# EAGLE design MCP16252 v1 (EAGLE 7.4.0)
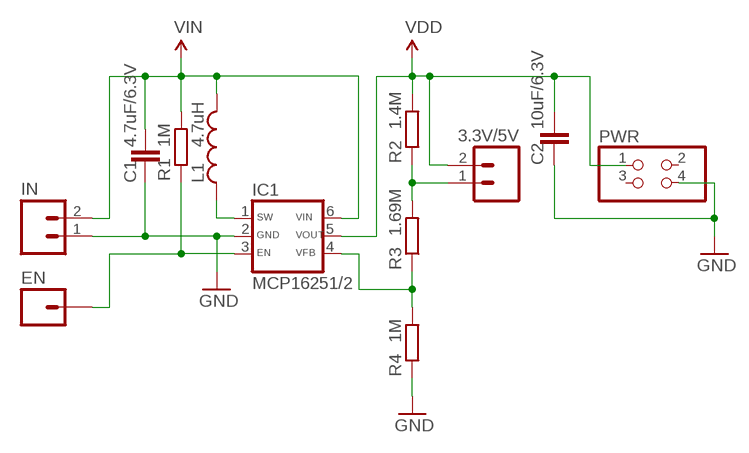
[diagram p0: schematic, sheet 1]

## Parts
3.3V/5V  M02PTH  [1X02]
C1  4.7uF/6.3V  CAPACITOR_NPOL-0805  [C805]
C2  10uF/6.3V  CAPACITOR_NPOL-0805  [C805]
EN  M01PTH  [1X01]
IC1  MCP16251/2  [SOT-23-6]
IN  M02PTH  [1X02]
L1  4.7uH  INDUCTOR1007  [1007]
PWR  PINHD-2X2  [2X02]
R1  1M  RESISTOR-0603  [R603]
R2  1.4M  RESISTOR-0603  [R603]
R3  1.69M  RESISTOR-0603  [R603]
R4  1M  RESISTOR-0603  [R603]

## Nets
EN: EN.1 IC1.3(EN) R1.1
GND: C1.2 C2.2 IC1.2(GND) IN.1 PWR.4 R4.1
N$1: IC1.1(SW) L1.1
N$3: IC1.4(VFB) R3.1 R4.2
N$4: 3.3V/5V.1 R2.1 R3.2
VDD: 3.3V/5V.2 C2.1 IC1.5(VOUT) PWR.1 R2.2
VIN: C1.1 IC1.6(VIN) IN.2 L1.2 R1.2
Unconnected: PWR.2 PWR.3

## Library data of the parts
3.3V/5V IN = SparkFun-Connectors:M02: Standard 2-pin 0.1" header. Use with - straight break away headers ( PRT-00116) - right angle break away headers (PRT-00553) - swiss pins (PRT-00743) - machine pins (PRT-00117) - female headers (PRT-00115) Molex polarized connector foot print use with: PRT-08233 with associated crimp pins and housings. 2.54_SCREWTERM for use with PRT-10571. 3.5mm Screw Terminal footprints for PRT-08084 5mm Screw Terminal footprints for use with PRT-08432
C1 C2 = dp_devices:CAPACITOR_NPOL: Non-Polarized capacitor in various packages
EN = SparkFun-Connectors:M01: Header 1 Standard 1-pin 0.1" header. Use with straight break away headers (SKU : PRT-00116), right angle break away headers (PRT-00553), swiss pins (PRT-00743), machine pins (PRT-00117), and female headers (PRT-00115).
IC1 = MCP16251-2:MCP16251/2
L1 = SparkFun-Passives:INDUCTOR: Inductors Basic Inductor/Choke - 0603 and 1206. Footprints are not proven and vary greatly between part numbers. SRN6045- 33uH, 20% 1.4A SDR0403-560KL - 56uH, 10%, 500mA RMS/740mA peak
PWR = pinhead:PINHD-2X2: PIN HEADER
R1-R4 = dp_devices:RESISTOR

## Board
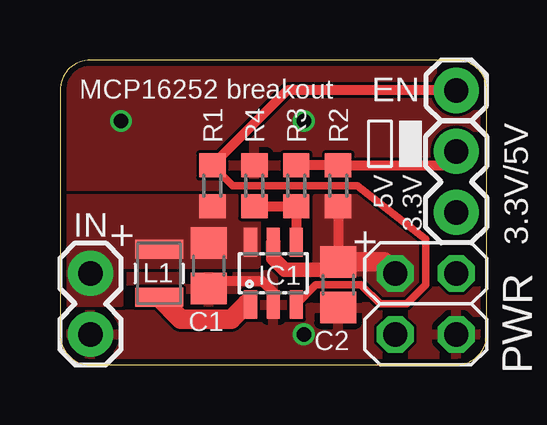
[diagram p1: board, top side]
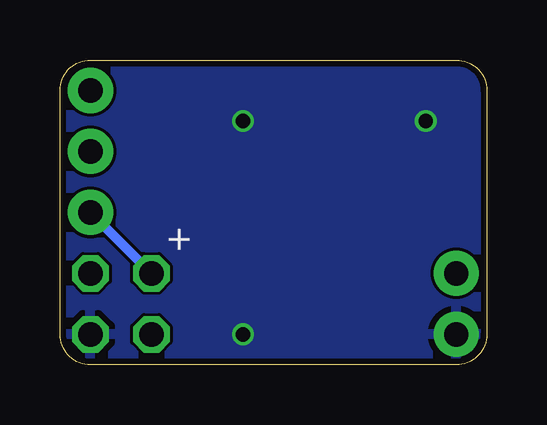
[diagram p2: board, bottom side, seen from below]

Size 17.78 x 12.7 mm. Coordinates in mm from the lower left corner, seen from the top.
Outline: 0,11.43 0,1.27 arc90 1.27,0 16.51,0 arc90 17.78,1.27 17.78,11.43 arc90 16.51,12.7 1.27,12.7 arc90 0,11.43
Copper layers (1*16): Top 0.035mm / dielectric 1.5mm / Bottom 0.035mm
Design rules "dirt_cheap_dirty_boards.v1": minimum track width 5mil, minimum drill 12mil, track to track 5mil, track to pad 5mil, pad to pad 5mil, via to via 5mil, smd to smd 0mil, copper to edge 10mil, drill to drill 10mil, minimum pad ring 10mil, minimum via ring 6mil, stop-mask expansion 2mil, vias tented up to drill 25mil, thermal gap 10mil

### Footprints (pad centres in the part's own frame; a part is rotated, then mirrored left to right if it is on the bottom)
1X02 = drill 1.016 pad 1.88: 1 0,0; 2 2.54,0
C805 = smd 1.3 x 1.5: 1 -0.95,0; 2 0.95,0
1X01 = drill 1.016 pad 1.88: 1 0,0
SOT-23-6 = smd 0.55 x 1.2: 1 -0.95,-1.3; 2 0,-1.3; 3 0.95,-1.3; 4 0.95,1.3; 5 0,1.3; 6 -0.95,1.3
1007 = smd 2 x 0.8: 1 0,1; 2 0,-1
2X02 = drill 1.016 octagon: 1 -1.27,-1.27; 2 -1.27,1.27; 3 1.27,-1.27; 4 1.27,1.27
R603 = smd 1 x 1.1: 1 -0.85,0; 2 0.85,0

### Placement (x,y rotation side)
3.3V/5V  16.51,8.89 270 top
C1  6.19,4.13 270 top
C2  11.59,3.33 270 top
EN  16.51,11.43 0 top
IC1  8.89,3.81 0 top
IN  1.27,1.27 90 top
L1  4.13,3.81 180 top
PWR  15.24,2.54 270 top
R1  6.35,7.46 270 top
R2  11.59,7.46 270 top
R3  9.84,7.46 90 top
R4  8.1,7.46 270 top

### Tracks (layer width: path | path; a pad name or v marks a point on that pad's centre or on a via)
EN
  Top 0.305: IC1.3 10.66,3.33 12.54,3.33 13.34,2.54 14.45,2.54 15.24,3.33 15.24,5.24 12.38,7.46 7.2,7.46 R1.1
  Top 0.406: EN.1 9.47,11.43 R1.1
GND  (via drill 0.6)
  Top 0.406: C1.2 6.51,3.49 8.41,3.49 8.89,3.02 IC1.2
  other vias: 2.54,10.16 10.16,10.16 10.16,1.27
  pour Bottom: 0,0 17.78,0 17.78,12.7 0,12.7
  pour Top (rank 2): 0,0 17.78,0 17.78,12.7 0,12.7
N$1
  Top 0.406: IC1.1 7.65,2.51 7.78,2.54
  Top 0.813: L1.1 5.03,1.91 7.14,1.91 7.78,2.54
N$3
  Top 0.406: R4.2 R3.1 IC1.4
N$4
  Top 0.406: R3.2 R2.1 15.93,8.31 3.3V/5V.1
VDD
  Top 0.406: R2.2 C2.1
  Top 0.61: IC1.5 8.89,4.45 9.37,3.97 11.27,3.97 C2.1
  Top 0.813: C2.1 13.5,4.28 PWR.1
  Bottom 0.406: PWR.1 3.3V/5V.2
  pour Top (no thermals): 10.64,3.81 12.7,3.81 12.7,2.86 15.24,2.86 15.24,4.92 12.54,6.99 10.64,6.99
VIN
  Top 0.406: 6.35,5.24 C1.1
  Top 0.813: 5.92,4.81 C1.1 6.22,5.11
  pour Top (no thermals): 0,2.54 2.54,2.54 2.54,4.13 8.26,4.13 8.26,6.99 0,6.99

### Text on the board
tNames: MCP16252 breakout | 5V / 3.3V | + | +
bNames: +